# EAGLE design Esp_Board (EAGLE 9.3.0)
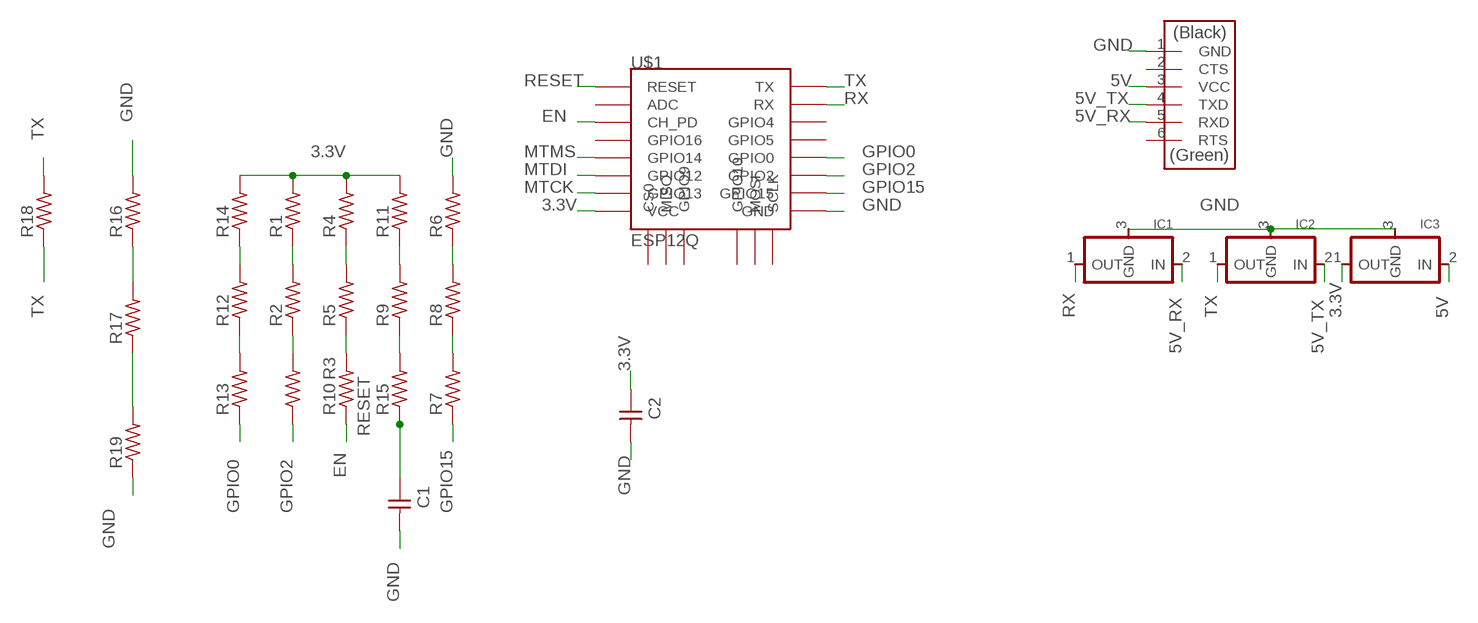
[diagram p0: schematic, sheet 1]

## Parts
C1  CAP-UNPOLARIZEDFAB  [C1206FAB]
C2  CAP-UNPOLARIZEDFAB  [C1206FAB]
IC1  REGULATORSOT23  [SOT23]
IC2  REGULATORSOT23  [SOT23]
IC3  REGULATORSOT23  [SOT23]
R1  RES-US1206FAB  [R1206FAB]
R2  RES-US1206FAB  [R1206FAB]
R3  RES-US1206FAB  [R1206FAB]
R4  RES-US1206FAB  [R1206FAB]
R5  RES-US1206FAB  [R1206FAB]
R6  RES-US1206FAB  [R1206FAB]
R7  RES-US1206FAB  [R1206FAB]
R8  RES-US1206FAB  [R1206FAB]
R9  RES-US1206FAB  [R1206FAB]
R10  RES-US1206FAB  [R1206FAB]
R11  RES-US1206FAB  [R1206FAB]
R12  RES-US1206FAB  [R1206FAB]
R13  RES-US1206FAB  [R1206FAB]
R14  RES-US1206FAB  [R1206FAB]
R15  RES-US1206FAB  [R1206FAB]
R16  RES-US1206FAB  [R1206FAB]
R17  RES-US1206FAB  [R1206FAB]
R18  RES-US1206FAB  [R1206FAB]
R19  RES-US1206FAB  [R1206FAB]
U$1  ESP12Q  [ESP12Q]
U$2  FTDI-SMD-HEADER  [1X06SMD]

## Nets
3.3V: C2.1 IC3.1(OUT) R1.2 R4.2 R11.2 R14.2 U$1.VCC
5V: IC3.2(IN) U$2.3(VCC)
5V_RX: IC1.2(IN) U$2.5(RXD)
5V_TX: IC2.2(IN) U$2.4(TXD)
EN: R10.1 U$1.CH_PD
GND: C1.2 C2.2 IC1.3(GND) IC2.3(GND) IC3.3(GND) R6.2 R16.1 R16.2 R17.1 R17.2 R19.1 R19.2 U$1.GND U$2.1(GND)
GPIO0: R13.1 U$1.GPIO0
GPIO2: R3.1 U$1.GPIO2
GPIO15: R7.1 U$1.GPIO15
MTCK: U$1.GPIO13
MTDI: U$1.GPIO12
MTMS: U$1.GPIO14
N$1: R12.2 R14.1
N$2: R12.1 R13.2
N$3: R2.1 R3.2
N$5: R1.1 R2.2
N$6: R4.1 R5.2
N$7: R5.1 R10.2
N$8: R9.1 R15.2
N$9: R9.2 R11.1
N$10: R6.1 R8.2
N$11: R7.2 R8.1
RESET: C1.1 R15.1 U$1.RESET
RX: IC1.1(OUT) U$1.RX
TX: IC2.1(OUT) R18.1 R18.2 U$1.TX
Unconnected: U$1.ADC U$1.CS0 U$1.GPIO4 U$1.GPIO5 U$1.GPIO9 U$1.GPIO10 U$1.GPIO16 U$1.MISO U$1.MOSI U$1.SCLK U$2.2(CTS) U$2.6(RTS)

## Library data of the parts
C1 C2 = fab:CAP-UNPOLARIZED
IC1-IC3 = fab:REGULATOR
R1-R19 = fab:RES-US: Resistor (US Symbol) Variants with postfix FAB are widened to allow the routing of internal traces
U$1 = esp826612q:ESP12Q: ESP8266 Wifi module 12-Q
U$2 = fab:FTDI-SMD-HEADER

## Board
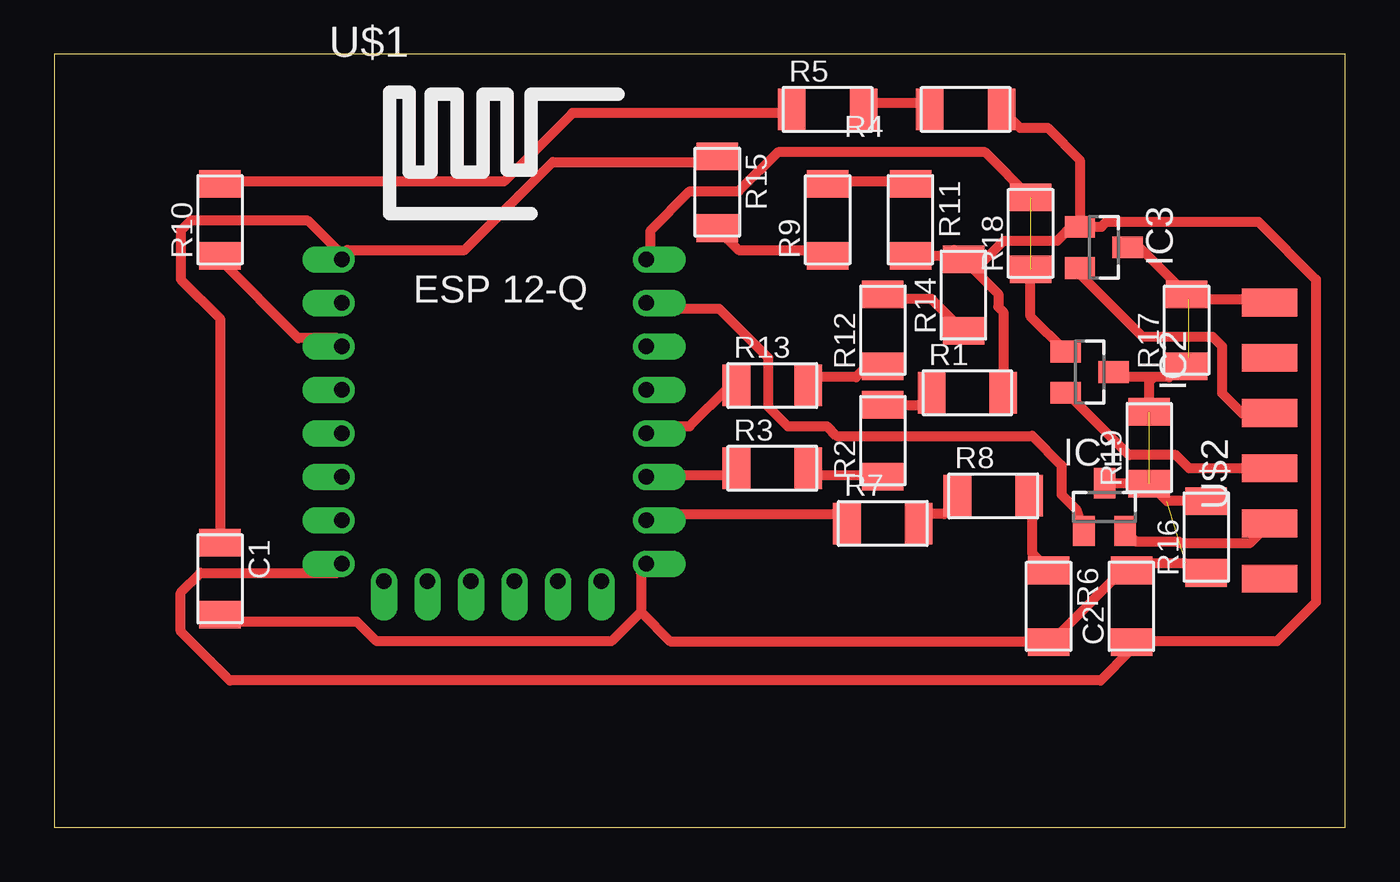
[diagram p1: board, top side]
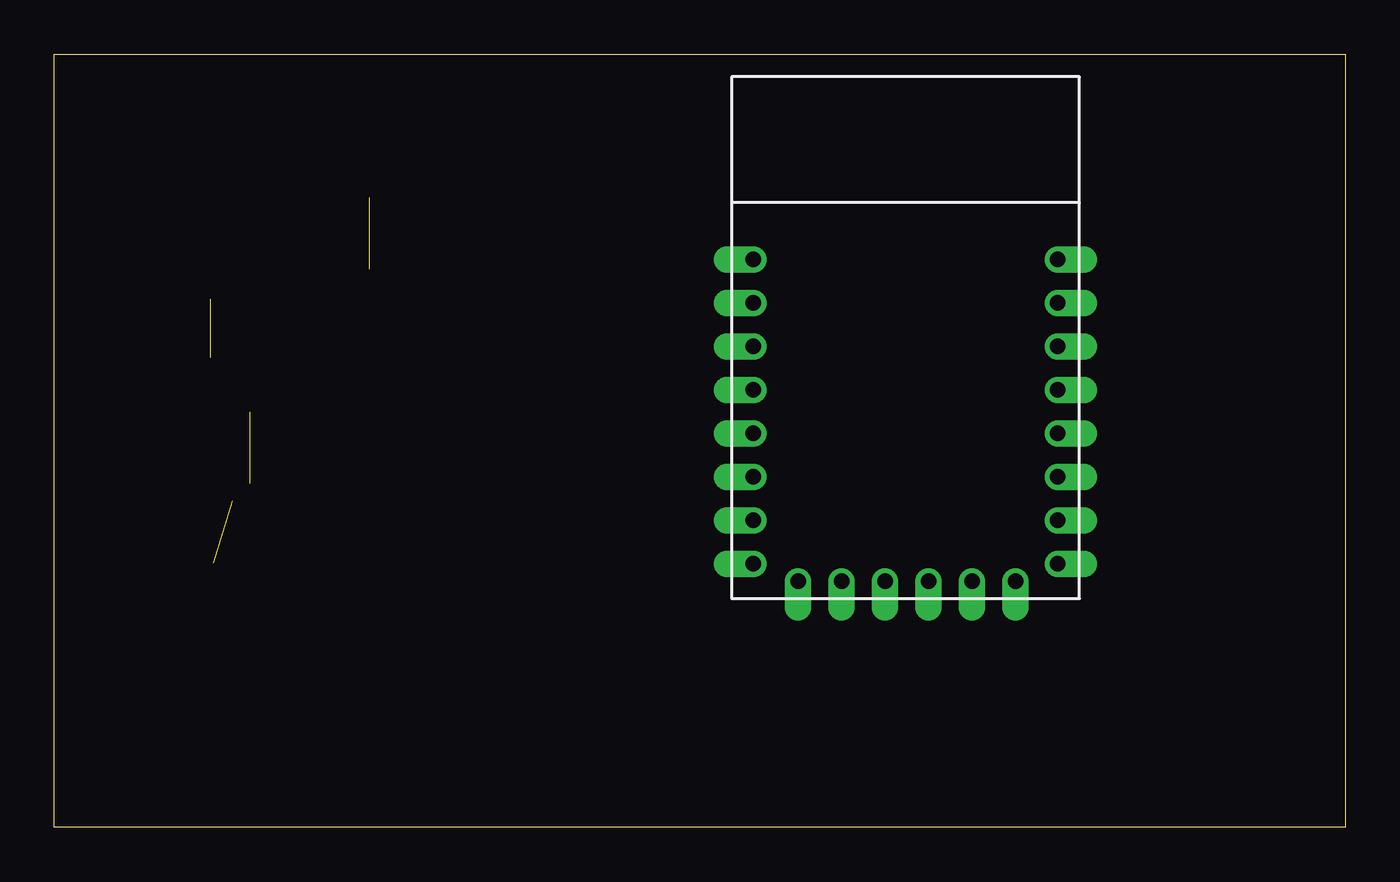
[diagram p2: board, bottom side, seen from below]

Size 59.36 x 35.55 mm. Coordinates in mm from the lower left corner, seen from the top.
Outline: 0,0 59.36,0 59.36,35.55 0,35.55 0,0
Copper layers (1*16): Top 0.035mm / dielectric 1.5mm / Bottom 0.035mm
Design rules "default *": minimum track width 0.45mm, minimum drill 0.35mm, track to track 0.45mm, track to pad 0.45mm, pad to pad 0.45mm, via to via 0.45mm, smd to smd 0.45mm, copper to edge 40mil, drill to drill 6mil, minimum pad ring 10mil, minimum via ring 8mil, stop-mask expansion 4mil, vias tented up to drill 0mil, thermal gap 10mil

### Footprints (pad centres in the part's own frame; a part is rotated, then mirrored left to right if it is on the bottom)
C1206FAB = smd 1.27 x 1.905: 1 -1.651,0; 2 1.651,0
SOT23 = smd 1 x 1.4: 1 -0.95,-1.1; 2 0.95,-1.1; 3 0,1.1
R1206FAB = smd 1.27 x 1.905: 1 -1.651,0; 2 1.651,0
ESP12Q = drill 0.7 offset: ADC -7.1,3.8; CH_PD -7.1,1.8; CS0 -5.165,-9.005; GND 6.9,-8.2; GPIO0 6.9,-2.2; GPIO2 6.9,-4.2; GPIO4 6.9,1.8; GPIO5 6.9,-0.2; GPIO9 -1.165,-9.005; GPIO10 0.835,-9.005; GPIO12 -7.1,-4.2; GPIO13 -7.1,-6.2; GPIO14 -7.1,-2.2; GPIO15 6.9,-6.2; GPIO16 -7.1,-0.2; MISO -3.165,-9.005; MOSI 2.835,-9.005; RESET -7.1,5.8; RX 6.9,3.8; SCLK 4.835,-9.005; TX 6.9,5.8; VCC -7.1,-8.2
1X06SMD = smd 2.54 x 1.27: 1 0,6.35; 2 0,3.81; 3 0,1.27; 4 0,-1.27; 5 0,-3.81; 6 0,-6.35

### Placement (x,y rotation side)
C1  7.62,11.43 270 top
C2  49.53,10.16 90 top
IC1  48.29,14.73 0 top
IC2  47.61,20.93 270 top
IC3  48.26,26.67 270 top
R1  41.99,19.98 0 top
R2  38.1,17.78 90 top
R3  33.02,16.51 0 top
R4  41.91,33.02 0 top
R5  35.56,33.02 0 top
R6  45.72,10.16 270 top
R7  38.1,13.97 0 top
R8  43.18,15.24 0 top
R9  35.56,27.94 90 top
R10  7.62,27.94 90 top
R11  39.37,27.94 270 top
R12  38.1,22.86 90 top
R13  33.02,20.32 0 top
R14  41.81,24.48 90 top
R15  30.48,29.21 270 top
R16  52.97,13.35 90 top
R17  52.07,22.86 90 top
R18  44.89,27.32 90 top
R19  50.35,17.46 90 top
U$1  20.32,20.32 0 top
U$2  55.88,17.78 0 top

### Tracks (layer width: path | path; a pad name or v marks a point on that pad's centre or on a via)
3.3V
  Top 0.45: 42.17,26.08 R14.2 | 39.57,26.55 R11.2 41.45,26.29 41.61,26.13 | R14.2 41.61,26.13 | 41.61,26.13 41.37,26.55 | IC3.1 46.89,27.76 46.12,26.98 43.66,26.98 42.81,26.13 R14.2 | 43.62,32.85 R4.2 44.41,32.17 45.68,32.17 47.16,30.69 IC3.1 | U$1.VCC 13.02,11.7 6.72,11.7 5.82,10.8 5.82,9 8.07,6.75 48.12,6.75 49.47,8.1 C2.1 49.92,8.55 56.22,8.55 58.02,10.35 58.02,25.2 55.38,27.84 48.38,27.84 48.15,27.62 IC3.1 | R14.2 43.4,24.53 43.4,23.93 43.64,23.7 R1.2
5V
  Top 0.45: IC3.2 47.16,25.45 50.04,22.56 53.26,22.56 53.7,22.12 53.7,19.96 54.61,19.05 U$2.3
5V_RX
  Top 0.45: 49.5,13.44 IC1.2 49.75,13.12 51.72,13.12 51.78,13.06 54.97,13.06 U$2.5 55.77,13.95
5V_TX
  Top 0.45: IC2.2 46.57,19.96 49.42,17.12 51.58,17.12 52.19,16.51 U$2.4
EN
  Top 0.45: R10.1 7.62,26.1 11.22,22.5 13.02,22.5 U$1.CH_PD
GND  (3 unrouted)
  Top 0.45: R16.1 52.03,12.15 49.92,12.15 C2.2 49.47,12.15 45.87,8.55 R6.2 45.42,8.55 28.32,8.55 26.97,9.9 | 26.97,9.9 25.62,8.55 14.82,8.55 13.92,9.45 7.62,9.45 C1.2 | 26.97,9.9 26.97,11.7 U$1.GND | IC1.3 48.6,15.69 48.72,15.81 R19.1 51.16,15 R16.2 52.62,15.12 | 50.55,20.7 51.27,20.7 51.72,21.15 R17.1 52.17,21.6 | 50.55,20.7 48.78,20.7 IC2.3 | U$2.1 55.77,24.3 52.17,24.3 R17.2 49.91,26.67 IC3.3 | R19.2 50.35,20.5 50.55,20.7
GPIO0
  Top 0.45: R13.1 31.02,20.25 29.22,18.45 27.42,18.45 U$1.GPIO0
GPIO2
  Top 0.45: R3.1 31.02,16.2 27.42,16.2 U$1.GPIO2
GPIO15
  Top 0.45: R7.1 36.42,14.4 27.42,14.4 U$1.GPIO15
N$1
  Top 0.45: 41.72,22.93 R14.1 40.34,24.3 38.22,24.3 R12.2
N$2
  Top 0.45: R13.2 35.07,20.7 36.87,20.7 37.77,21.6 R12.1
N$3
  Top 0.45: R2.1 37.77,16.2 35.07,16.2 R3.2
N$5
  Top 0.45: 38.22,19.8 R2.2 39.78,19.43 R1.1
N$6
  Top 0.45: R5.2 37.32,33.3 40.02,33.3 R4.1
N$7
  Top 0.45: R10.2 7.62,29.7 20.67,29.7 23.82,32.85 33.72,32.85 R5.1
N$8
  Top 0.45: R9.1 35.52,26.55 31.47,26.55 30.57,27.45 R15.2
N$9
  Top 0.45: R9.2 35.97,29.7 39.12,29.7 R11.1
N$10
  Top 0.45: R8.2 44.97,14.85 44.97,12.6 45.42,12.15 R6.1
N$11
  Top 0.45: R7.2 40.02,14.4 40.92,14.4 41.37,14.85 R8.1
RESET
  Top 0.45: C1.1 7.62,23.4 5.82,25.2 5.82,27.45 6.27,27.9 11.67,27.9 13.02,26.55 U$1.RESET 13.47,26.55 18.87,26.55 22.92,30.6 30.12,30.6 R15.1
RX
  Top 0.45: IC1.1 47,14.62 46.32,15.3 46.32,16.65 44.97,18 35.97,18 35.52,18.45 33.72,18.45 32.82,19.35 32.82,21.6 30.57,23.85 27.42,23.85 U$1.RX
TX  (1 unrouted)
  Top 0.45: 46.12,22.21 IC2.1 44.89,23.5 R18.1 | U$1.TX 27.42,26.55 27.42,27.45 29.22,29.25 31.47,29.25 33.27,31.05 42.81,31.05 R18.2